# EAGLE design untitled (EAGLE 5.10)
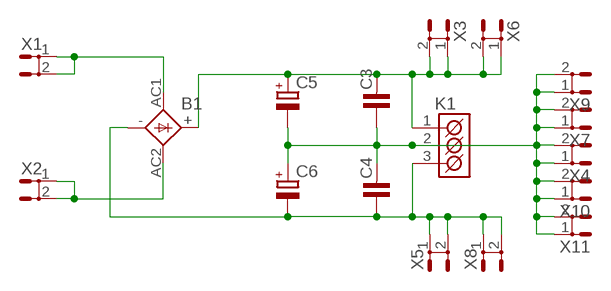
[diagram p0: schematic, sheet 1]

## Parts
B1  DSI32  [DSI32]
C3  C-KERAMIK_5  [C-5]
C4  C-KERAMIK_5  [C-5]
C5  CPOL-EUE10-35  [EB35D]
C6  CPOL-EUE10-35  [EB35D]
K1  ARK500/3  [ARK500/3]
X1  ST4,8  [ST4,8]
X2  ST4,8  [ST4,8]
X3  ST4,8  [ST4,8]
X4  ST4,8  [ST4,8]
X5  ST4,8  [ST4,8]
X6  ST4,8  [ST4,8]
X7  ST4,8  [ST4,8]
X8  ST4,8  [ST4,8]
X9  ST4,8  [ST4,8]
X10  ST4,8  [ST4,8]
X11  ST4,8  [ST4,8]

## Nets
N$1: B1.AC1 X1.1 X1.2
N$2: B1.AC2 X2.1 X2.2
N$3: B1.+ C3.2 C5.+ K1.1(K1) X3.1 X3.2 X6.1 X6.2
N$4: B1.- C4.1 C6.- K1.3(K3) X5.1 X5.2 X8.1 X8.2
N$5: C3.1 C4.2 C5.- C6.+ K1.2(K2) X4.1 X4.2 X7.1 X7.2 X9.1 X9.2 X10.1 X10.2 X11.1 X11.2

## Library data of the parts
B1 = rectifier:DSI32: RECTIFIER 3.2 A
C3 C4 = #PaJa_22:C-KERAMIK: Kondenzator - keramicky
C5 C6 = rcl:CPOL-EU: POLARIZED CAPACITOR, European symbol
K1 = #PaJa_22:ARK500/3: Svorkovnice - roztec 5mm - trojita
X1-X11 = con-rib:ST4,8: RIBBON CABLE CONNECTOR Flachstecker / Faston

## Board
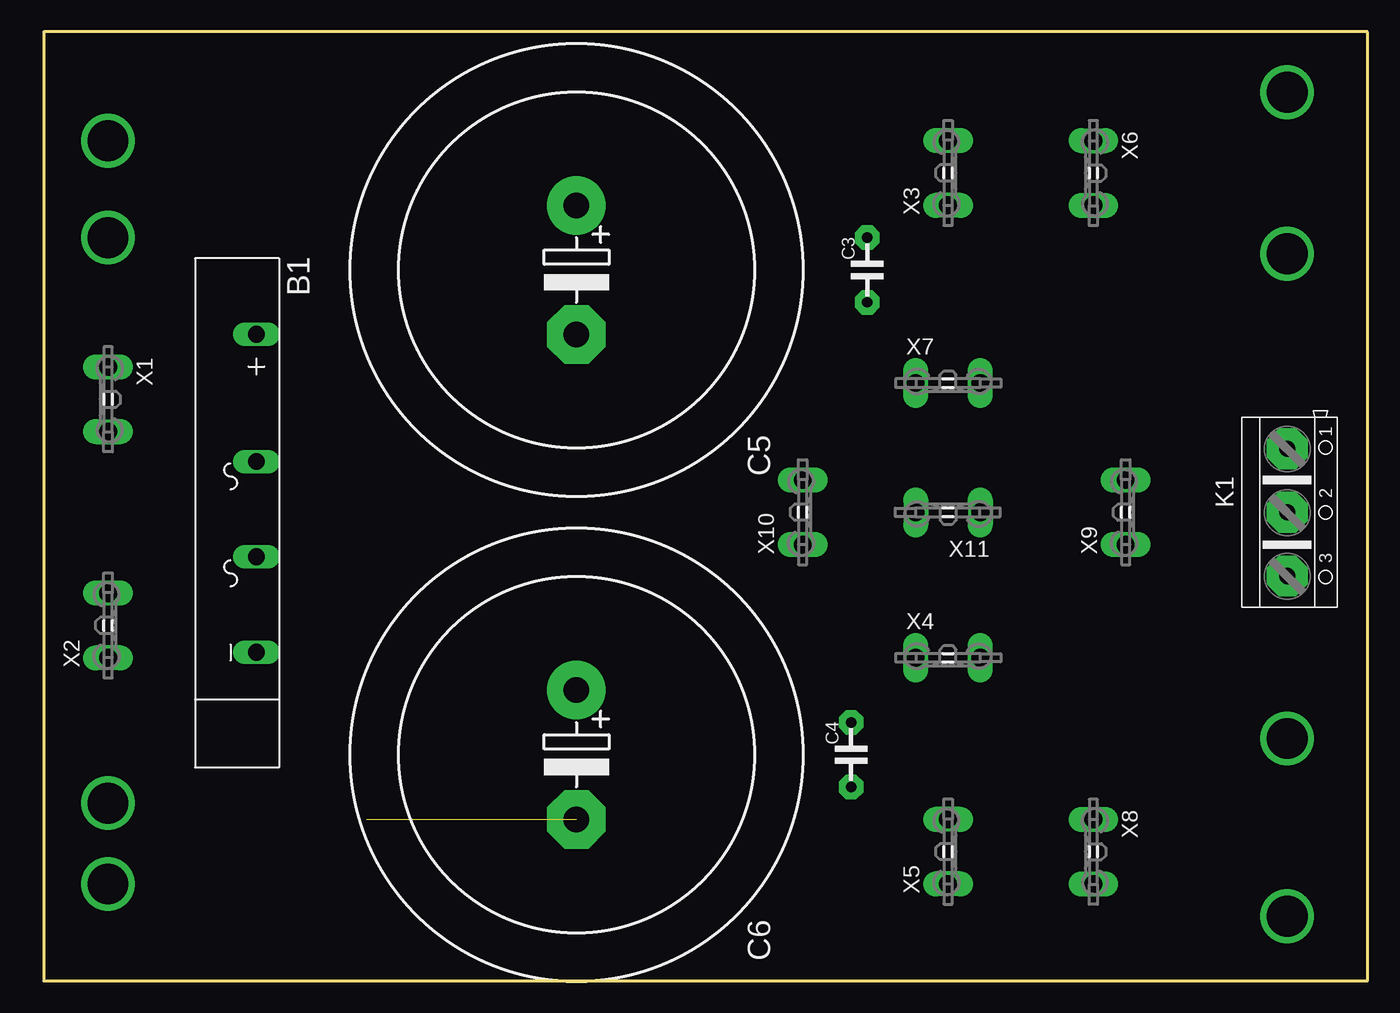
[diagram p1: board, top side]
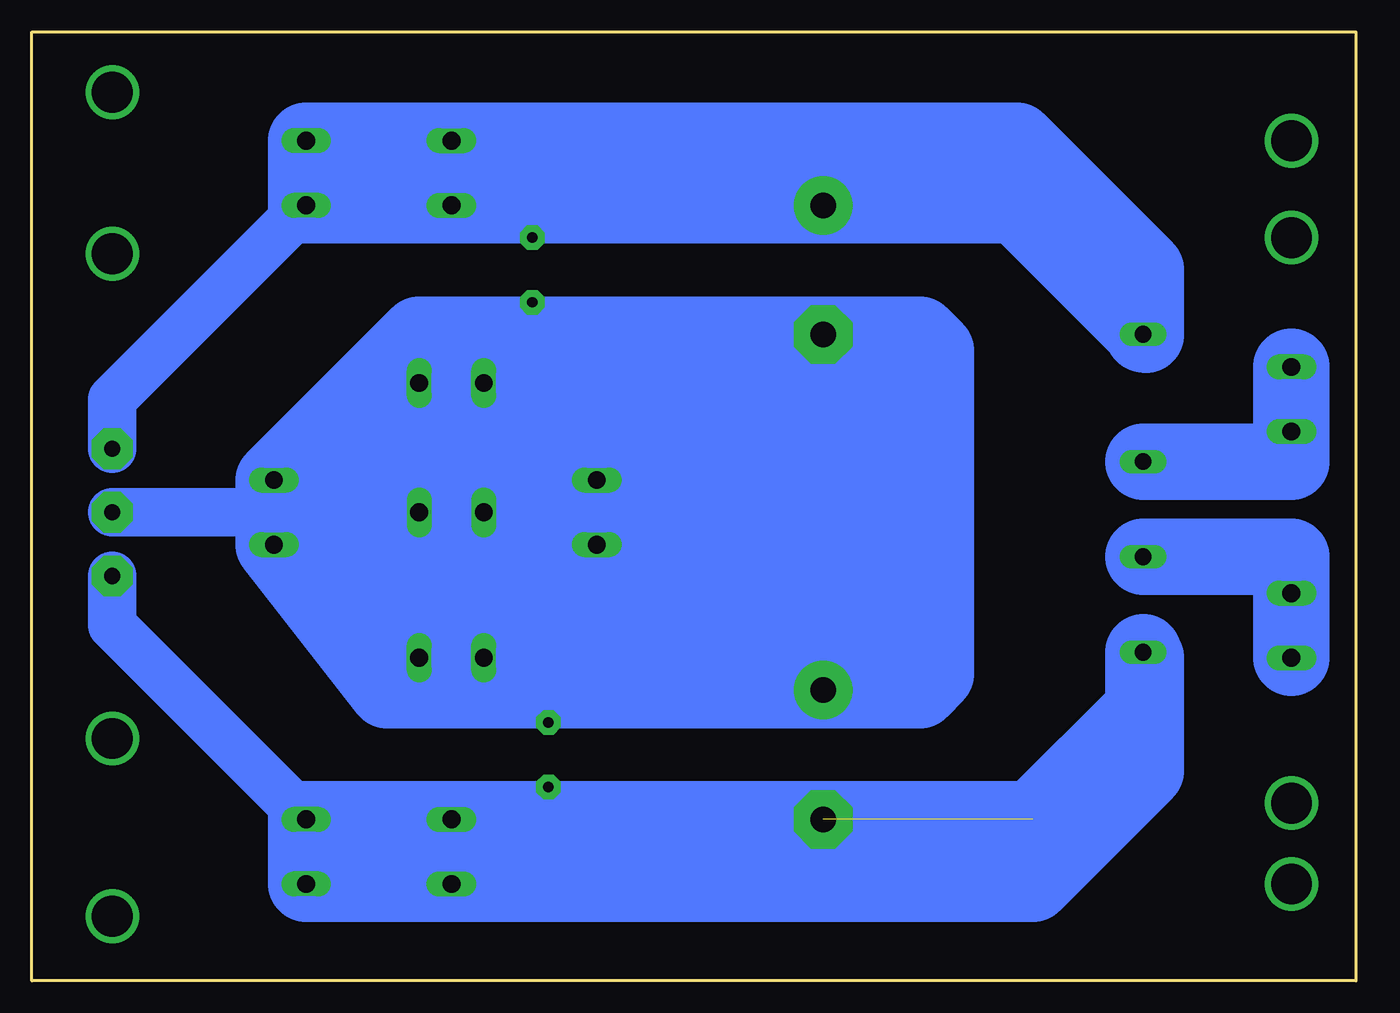
[diagram p2: board, bottom side, seen from below]

Size 104.12 x 74.6 mm. Coordinates in mm from the lower left corner, seen from the top.
Outline: 0,0 104.12,0 104.12,74.6 0,74.6 0,0
Copper layers (1*16): Top 0.035mm / dielectric 1.5mm / Bottom 0.035mm
Design rules "default *": minimum track width 10mil, minimum drill 24mil, track to track 8mil, track to pad 8mil, pad to pad 8mil, via to via 8mil, smd to smd 8mil, copper to edge 40mil, drill to drill 8mil, minimum pad ring 10mil, minimum via ring 8mil, stop-mask expansion 4mil, vias tented up to drill 0mil, thermal gap 10mil

### Footprints (pad centres in the part's own frame; a part is rotated, then mirrored left to right if it is on the bottom)
DSI32 = drill 1.321 long: + -14,1.5; - 10.994,1.5; AC1 -3.992,1.5; AC2 3.501,1.5
C-5 = drill 0.813 pad 1.93 octagon: 1 -2.54,0; 2 2.54,0
EB35D = drill 2.007 pad 4.597 round: + -5.08,0 | drill 2.007 pad 4.597 octagon: - 5.08,0
ARK500/3 = drill 1.27 pad 3.2 octagon: 1 -5,0; 2 0,0; 3 5,0
ST4,8 = drill 1.397 long: 1 -2.54,0; 2 2.54,0

### Placement (x,y rotation side)
B1  15.24,36.83 270 top
C3  64.77,55.88 90 top
C4  63.5,17.78 90 top
C5  41.91,55.88 270 top
C6  41.91,17.78 270 top
K1  97.79,36.83 270 top
X1  5.08,45.72 270 top
X2  5.08,27.94 90 top
X3  71.12,63.5 90 top
X4  71.12,25.4 0 top
X5  71.12,10.16 90 top
X6  82.55,63.5 270 top
X7  71.12,46.99 0 top
X8  82.55,10.16 270 top
X9  85.09,36.83 90 top
X10  59.69,36.83 90 top
X11  71.12,36.83 180 top

### Tracks (layer width: path | path; a pad name or v marks a point on that pad's centre or on a via)
N$1
  Bottom 6: B1.AC1 5.08,40.82 X1.2 X1.1
N$2
  Bottom 6: B1.AC2 5.08,33.33 X2.2 X2.1
N$3
  Bottom 0.61: C3.2 68.58,58.42 X3.1 X3.2 | C5.+ 60.96,60.96 66.04,66.04 X6.1 83.82,66.04
  Bottom 3.81: K1.1 97.79,45.72 X6.2
  Bottom 6: B1.+ 16.74,51.03 26.67,60.96 C5.+ X3.1 X6.2 X6.1 X3.2 66.04,66.04 26.67,66.04 16.51,55.88 16.51,50.8
N$4  (1 unrouted)
  Bottom 0.61: 63.5,13.97 C4.1
  Bottom 3.81: K1.3 97.79,27.94 X8.1 | X5.1 X5.2 64.77,12.7 63.5,13.97
  Bottom 6: B1.- 16.74,21.36 25.4,12.7 X5.2 X8.1 X8.2 X5.1 25.4,7.62 16.51,16.51 16.51,25.4
N$5
  Bottom 0.61: X10.1 X10.2 66.04,39.37 X11.2 | X11.2 67.31,36.83 | X11.2 X11.1 | X7.1 X7.2 73.66,49.53 74.3,50.16 | C3.1 64.77,50.8 X7.1 | X7.1 X11.2 | 76.2,22.86 X4.2 X4.1 C4.2
  Bottom 3.81: 71.12,36.83 X11.1 K1.2
  Bottom 6: C5.- 73.66,50.8 74.3,50.16 X9.2 X9.1 76.2,22.86 C6.+ 34.29,22.86 33.02,24.13 33.02,49.53 34.29,50.8 C5.-
N$6  (via drill 3.2)
  other vias: 5.08,13.97
N$7  (via drill 3.2)
  other vias: 5.08,7.62
N$8  (via drill 3.2)
  other vias: 5.08,58.42
N$9  (via drill 3.2)
  other vias: 5.08,66.04
N$10  (via drill 3.2)
  other vias: 97.79,57.15
N$12  (via drill 3.2)
  other vias: 97.79,69.85
N$13  (via drill 3.2)
  other vias: 97.79,5.08
N$14  (via drill 3.2)
  other vias: 97.79,19.05
(copper drawn outside any net)
  shapes: Bottom area x4